# EAGLE design yetisponder_vesp02.2.1 (EAGLE 6.4)
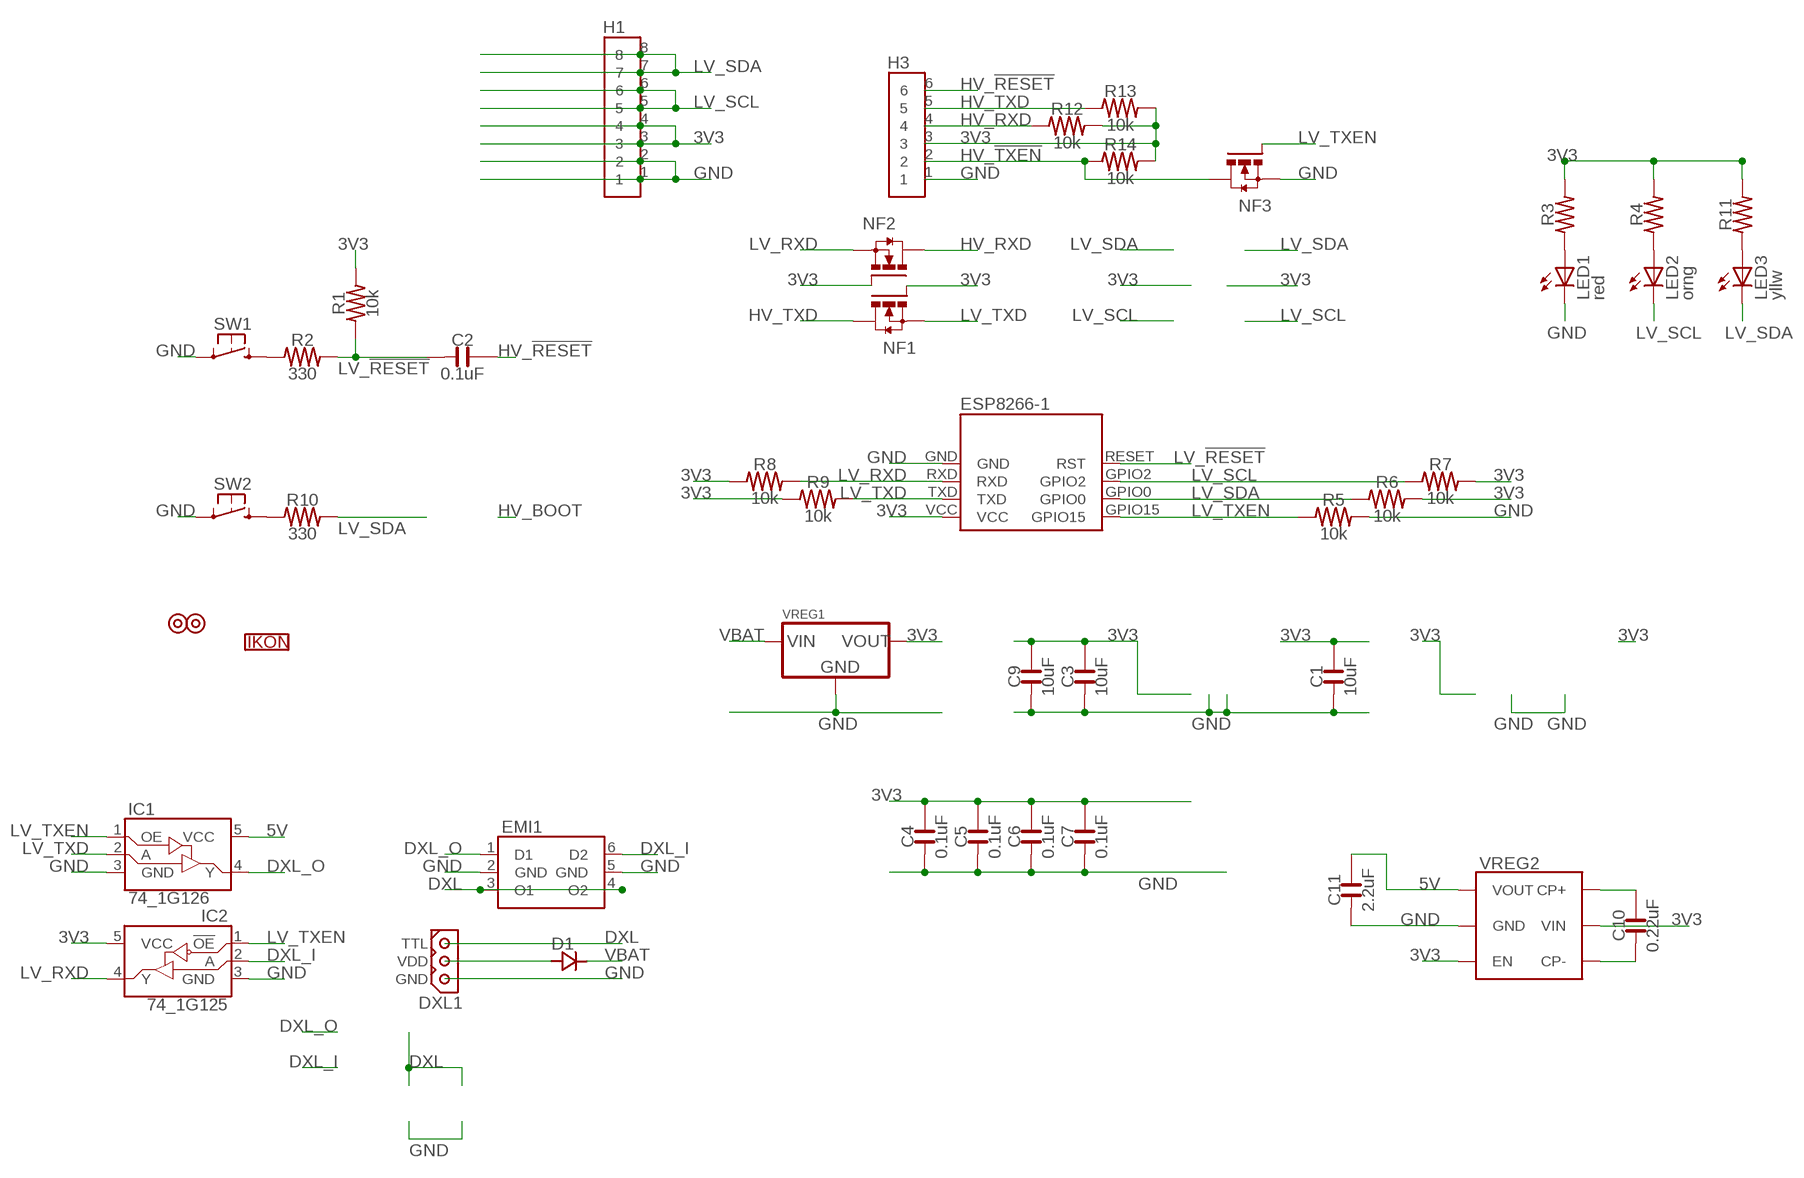
[diagram p0: schematic, sheet 1]

## Parts
C1  10uF  CAPACITOR-0805  [0805_YAGEO]
C2  0.1uF  CAPACITOR-0402  [0402_YAGEO]
C3  10uF  CAPACITOR-0805  [0805_YAGEO]
C4  0.1uF  CAPACITOR-0402  [0402_YAGEO]
C5  0.1uF  CAPACITOR-0402  [0402_YAGEO]
C6  0.1uF  CAPACITOR-0402  [0402_YAGEO]
C7  0.1uF  CAPACITOR-0402  [0402_YAGEO]
C9  10uF  CAPACITOR-0805  [0805_YAGEO]
C10  0.22uF  CAPACITOR-0402  [0402_YAGEO]
C11  2.2uF  CAPACITOR-0402  [0402_YAGEO]
D1  DIODE_RECTIFIER-POWER-DI5  [POWER-DI5]
DXL1  DXL_TTL-V  [MOLEX_5267-3]
EMI1  EMI_2CH  [SOT-563]
ESP8266-1  ESP8266-02  [ESP8266-02]
H1  HEADER_8P-0.1"_2X4-SMD-SULLINS  [HEADER-0.1"_2X4-SMD-SULLINS]
H3  HEADER_6P-0.1"  [HEADER-0.1"_1X6]
IC1  LOGIC_74_1G126-DCK  [DCK(R-PDSO-G5)_SC70]
IC2  LOGIC_74_1G125-DCK  [DCK(R-PDSO-G5)_SC70]
IKON1  IKON-VERSACOMA-5  [IKON_VERSACOMA_5MM]
LED1  red  LED-0402  [0402_LED]
LED2  orng  LED-0402  [0402_LED]
LED3  yllw  LED-0402  [0402_LED]
NF1  FET_N-CH-SOT-23-3  [SOT-23-3]
NF2  FET_N-CH-SOT-23-3  [SOT-23-3]
NF3  FET_N-CH-SOT-23-3  [SOT-23-3]
R1  10k  RESISTOR-0402  [0402_YAGEO]
R2  330  RESISTOR-0402  [0402_YAGEO]
R3  RESISTOR-0402  [0402_YAGEO]
R4  RESISTOR-0402  [0402_YAGEO]
R5  10k  RESISTOR-0402  [0402_YAGEO]
R6  10k  RESISTOR-0402  [0402_YAGEO]
R7  10k  RESISTOR-0402  [0402_YAGEO]
R8  10k  RESISTOR-0402  [0402_YAGEO]
R9  10k  RESISTOR-0402  [0402_YAGEO]
R10  330  RESISTOR-0402  [0402_YAGEO]
R11  RESISTOR-0402  [0402_YAGEO]
R12  10k  RESISTOR-0402  [0402_YAGEO]
R13  10k  RESISTOR-0402  [0402_YAGEO]
R14  10k  RESISTOR-0402  [0402_YAGEO]
S1  METRIC_SCREWS-M2.5_T  [M2.5_SCREW_TENTED]
S2  METRIC_SCREWS-M2.5_T  [M2.5_SCREW_TENTED]
SW1  SWITCH_SPST-6MMX6MM-PTH  [SWITCH_TE_1825910-7]
SW2  SWITCH_SPST-6MMX6MM-PTH  [SWITCH_TE_1825910-7]
VREG1  VREG_78XX-OKI-78SR-H  [VREG-OKI-78SR-H]
VREG2  VREG_REG710XX  [SOT-23-6]

## Nets
3V3: C1.2 C3.2 C4.2 C5.2 C6.2 C7.2 C9.2 ESP8266-1.VCC H1.3 H1.4 H3.3 IC2.5(VCC) NF1.1G(G) NF2.1G(G) R1.2 R3.2 R4.2 R6.2 R7.2 R8.1 R9.1 R11.2 R12.2 R13.2 R14.2 VREG1.3(VOUT) VREG2.3(EN) VREG2.5(VIN)
5V: C11.2 IC1.5(VCC) VREG2.1(VOUT)
DXL: DXL1.1(TTL) EMI1.3(O1) EMI1.4(O2)
DXL_I: EMI1.6(D2) IC2.2(A)
DXL_O: EMI1.1(D1) IC1.4(Y)
GND: C1.1 C3.1 C4.1 C5.1 C6.1 C7.1 C9.1 C11.1 DXL1.3(GND) EMI1.2(GND) EMI1.5(GND) ESP8266-1.GND H1.1 H1.2 H3.1 IC1.3(GND) IC2.3(GND) LED1.C NF3.2S(S) R5.2 SW1.2@1 SW1.2@2 SW2.2@1 SW2.2@2 VREG1.2(GND) VREG2.2(GND)
HV_!RESET!: C2.2 H3.6
HV_!TXEN!: H3.2 NF3.3D(D) R14.1
HV_RXD: H3.4 NF2.3D(D) R12.1
HV_TXD: H3.5 NF1.3D(D) R13.1
LV_!RESET!: C2.1 ESP8266-1.RESET(RST) R1.1 R2.2
LV_RXD: ESP8266-1.RXD IC2.4(Y) NF2.2S(S) R8.2
LV_SCL: ESP8266-1.GPIO2 H1.5 H1.6 LED2.C R7.1
LV_SDA: ESP8266-1.GPIO0 H1.7 H1.8 LED3.C R6.1 R10.2
LV_TXD: ESP8266-1.TXD IC1.2(A) NF1.2S(S) R9.2
LV_TXEN: ESP8266-1.GPIO15 IC1.1(OE) IC2.1(!OE!) NF3.1G(G) R5.1
N$1: R10.1 SW2.1@1 SW2.1@2
N$3: LED3.A R11.1
N$4: C10.2 VREG2.6(CP+)
N$5: D1.LEFT(A) D1.RIGHT(A) DXL1.2(VDD)
N$6: LED1.A R3.1
N$7: R2.1 SW1.1@1 SW1.1@2
N$8: LED2.A R4.1
N$9: C10.1 VREG2.4(CP-)
VBAT: D1.PAD(C) VREG1.1(VIN)
Unconnected: S1.P$1 S2.P$1

## Library data of the parts
C1-C7 C9-C11 = NaN:CAPACITOR
D1 = NaN:DIODE_RECTIFIER
DXL1 = NaN:DXL_TTL
EMI1 = NaN:EMI_2CH: 2CH EMI/ESD Filter NUF2230XV6 (D1-O1)(D2-O2)
ESP8266-1 = NaN:ESP8266-02
H1 = NaN:HEADER_8P
H3 = NaN:HEADER_6P
IC1 = NaN:LOGIC_74_1G126
IC2 = NaN:LOGIC_74_1G125
IKON1 = NaN:IKON
LED1-LED3 = NaN:LED: LEDs
NF1-NF3 = NaN:FET_N-CH
R1-R14 = NaN:RESISTOR
S1 S2 = NaN:METRIC_SCREWS
SW1 SW2 = NaN:SWITCH_SPST
VREG1 = NaN:VREG_78XX: 3-pin LDO Voltage Regulators SOT-23-3 IOG: Diodes, Inc. - AP7313, AP7333; Richtek - RT9058; GOI: Diodes, Inc. - AP2210, AP7313-R, AP7333-R; Microchip - MCP1700, MCP1702, MCP1745S; Richtek - RT9169L, RT9058L; GIO: Diodes, Inc. - AP1117; OGI: Richtek - RT9169; OIG: Diodes, Inc. - ZMRxxx; TI - LM3480; SOT-223 IGO: Diodes, Inc. - AZ1117-H2; AP2114-HA; Microchip - MCP1745S, MCP1826; GOI: Diodes, Inc. - AZ1117-H; AP2114-H; ST - LD1117; SOT-89-3 IGO: Diodes, Inc. - AP2204-R; Microchip - MCP1745S; IOG: Richtek - RT9058; GIO: Diodes, Inc. - AP1117, AZ1117-R2, AP2204-RA, ZXTR2012Z; Microchip - MCP1700, MCP1702; Ricktek - RT9169; GOI: Diodes, Inc. - AZ1117-R; OGI: Fairchild - MC78LxxA; TI - uA78L00; ST - L78L; POWER-DI5 GOI: Diodes, Inc. - ZXTR2012P5; TO-252-3 GOI: Diodes, Inc. - AZ1117, AP1117; ST - LD1117; TO-263-3 GOI: Diodes, Inc. - AP1117;
VREG2 = NaN:VREG_REG710XX

## Board
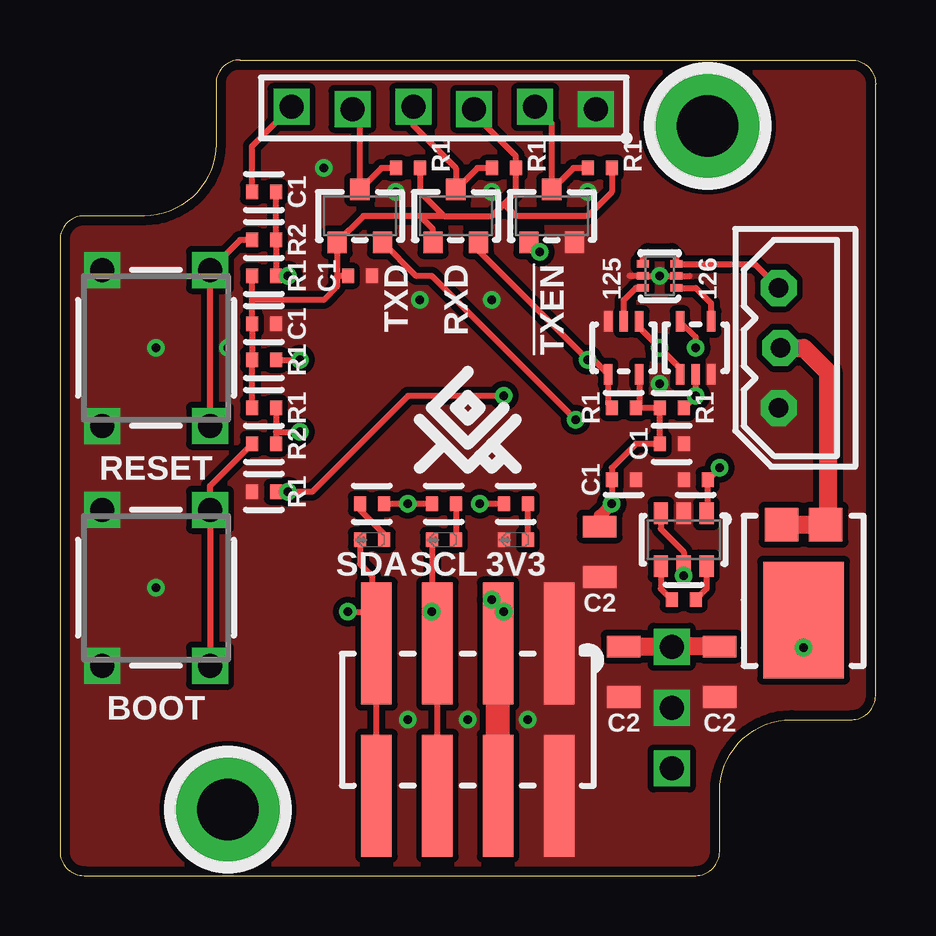
[diagram p1: board, top side]
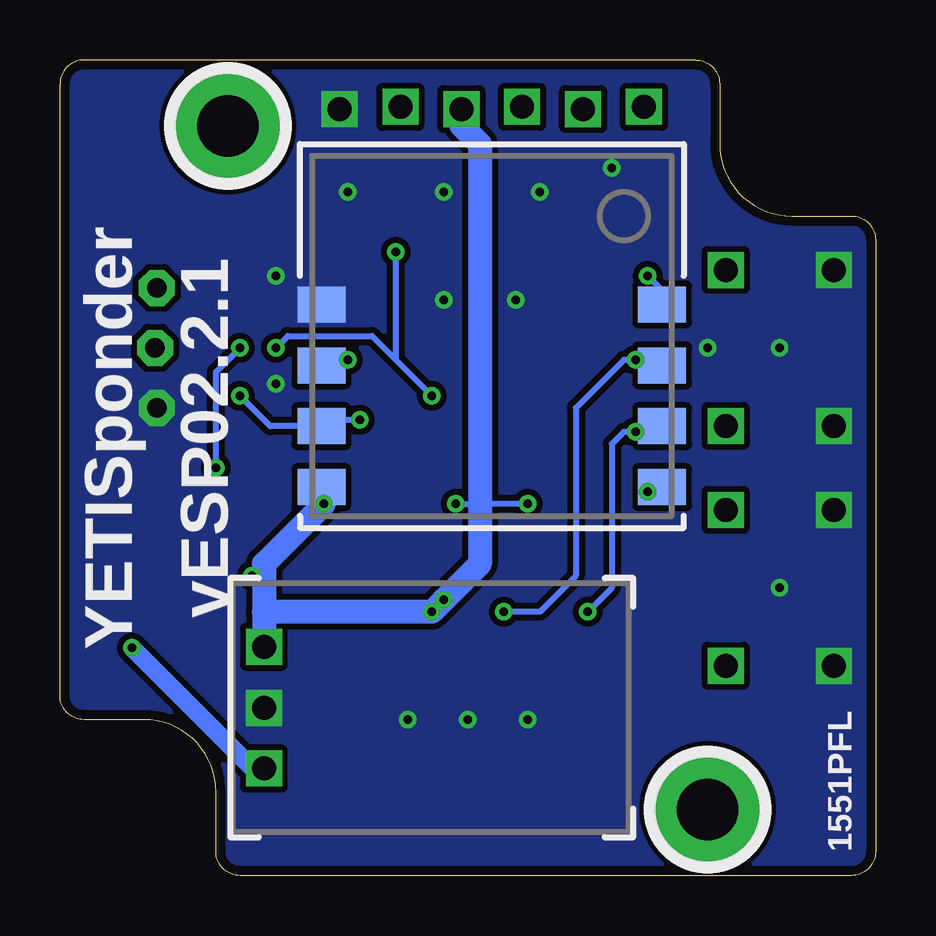
[diagram p2: board, bottom side, seen from below]

Size 34 x 34 mm. Coordinates in mm from the lower left corner, seen from the top.
Outline: 3.5,27.5 1,27.5 arc90 0,26.5 0,1 arc90 1,0 26.5,0 arc90 27.5,1 27.5,3.5 arc-90 30.5,6.5 33,6.5 arc90 34,7.5 34,33 arc90 33,34 7.5,34 arc90 6.5,33 6.5,30.5 arc-90 3.5,27.5
Copper layers (1*16): Top 0.0356mm / dielectric 1.5011mm / Bottom 0.0356mm
Design rules "LaenPCBOrder_mod_metric": minimum track width 0.16mm, minimum drill 0.35mm, track to track 0.16mm, track to pad 0.16mm, pad to pad 0.16mm, via to via 0.16mm, smd to smd 0mil, copper to edge 0.4mm, drill to drill 0.16mm, minimum pad ring 0.18mm, minimum via ring 0.18mm, stop-mask expansion 0.102mm, vias tented up to drill 2mm, thermal gap 10mil

### Footprints (pad centres in the part's own frame; a part is rotated, then mirrored left to right if it is on the bottom)
0805_YAGEO = smd 1.4 x 0.9: 1 0,1.05; 2 0,-1.05
0402_YAGEO = smd 0.6 x 0.5: 1 0,0.5; 2 0,-0.5
POWER-DI5 = smd 1.39 x 1.4: LEFT -0.92,-1.126; RIGHT 0.92,-1.126 | smd 3.36 x 4.86: PAD 0,2.856
MOLEX_5267-3 = drill 0.8 pad 1.5 octagon: 1 0.04,-2.5; 2 -0.04,0; 3 0.04,2.5
SOT-563 = smd 0.3 x 0.5: 1 -0.5,-0.7; 2 0,-0.7; 3 0.5,-0.7; 4 0.5,0.7; 5 0,0.7; 6 -0.5,0.7
ESP8266-02 = smd 2 x 1.5: GND -7.1,3.81; GPIO0 7.1,-1.27; GPIO2 7.1,1.27; GPIO15 7.1,-3.81; RESET 7.1,3.81; RXD -7.1,1.27; TXD -7.1,-1.27; VCC -7.1,-3.81
HEADER-0.1"_2X4-SMD-SULLINS = smd 1.27 x 5.08: 1 -3.81,-3.175; 2 -3.81,3.175; 3 -1.27,-3.175; 4 -1.27,3.175; 5 1.27,-3.175; 6 1.27,3.175; 7 3.81,-3.175; 8 3.81,3.175
HEADER-0.1"_1X6 = drill 1 square: 1 -6.35,0.05; 2 -3.81,-0.05; 3 -1.27,0.05; 4 1.27,-0.05; 5 3.81,0.05; 6 6.35,-0.05
DCK(R-PDSO-G5)_SC70 = smd 0.35 x 0.85: 1 -0.65,-1.1; 2 0,-1.1; 3 0.65,-1.1; 4 0.65,1.1; 5 -0.65,1.1
0402_LED = smd 0.6 x 0.5: A 0,-0.5; C 0,0.5
SOT-23-3 = smd 0.8 x 0.9: 1G -0.95,-1.1; 2S 0.95,-1.1; 3D 0,1.1
M2.5_SCREW_TENTED = drill 2.55 pad 5.2: P$1 0,0
SWITCH_TE_1825910-7 = drill 1 square: 1@1 -3.25,2.25; 1@2 3.25,2.25; 2@1 -3.25,-2.25; 2@2 3.25,-2.25
VREG-OKI-78SR-H = drill 1 square: 1 2.54,0; 2 0,0; 3 -2.54,0
SOT-23-6 = smd 0.6 x 0.9: 1 -0.95,-1.1; 2 0,-1.1; 3 0.95,-1.1; 4 0.95,1.1; 5 0,1.1; 6 -0.95,1.1

### Placement (x,y rotation side)
C1  22.5,13.5 180 top
C2  8.5,28.5 270 top
C3  27.5,8.5 180 top
C4  12.5,25 270 top
C5  23.5,16.5 270 top
C6  25.5,18 270 top
C7  8.5,23 270 top
C9  23.5,8.5 180 top
C10  26,11.5 90 top
C11  26.5,16.5 90 top
D1  31,13.5 180 top
DXL1  30,22 180 top
EMI1  25,25 90 top
ESP8266-1  16,20 0 bottom
H1  17,6.5 180 top
H3  16,32 180 top
IC1  26.5,22 0 top
IC2  23.5,22 180 top
IKON1  17,19 0 top
LED1  19,14 90 top
LED2  16,14 90 top
LED3  13,14 90 top
NF1  12.5,27.5 0 top
NF2  16.5,27.5 0 top
NF3  20.5,27.5 0 top
R1  8.5,25 270 top
R2  8.5,26.5 90 top
R3  19,15.5 270 top
R4  16,15.5 270 top
R5  8.5,16 270 top
R6  8.5,19.5 270 top
R7  8.5,21.5 270 top
R8  23.5,19.5 270 top
R9  25.5,19.5 90 top
R10  8.5,18 90 top
R11  13,15.5 90 top
R12  18.5,29.5 90 top
R13  14.5,29.5 90 top
R14  22.5,29.5 90 top
S1  7,2.75 0 top
S2  27,31.25 0 top
SW1  4,22 270 top
SW2  4,12 270 top
VREG1  25.5,7 270 bottom
VREG2  26,14 180 top

### Tracks (layer width: path | path; a pad name or v marks a point on that pad's centre or on a via)
3V3  (via drill 0.35)
  Top 0.25: R6.2 R7.2 C7.2 8,24 | NF2.1G 15.55,26.95 15,27.5 | 15,27.5 12.65,27.5 NF1.1G 11.55,25 | 8,24 R1.2 | 11.55,25 11.55,24.55 11,24 8,24 | C4.2 11.55,25 | v23,15.5 23,17 24,18 C6.2 R9.1 R8.1 24.15,19.65 IC2.5 | C5.2 v23,15.5 | R13.2 15,28.5 16,27.5 | 16,27.5 18,27.5 18.5,28 | 18.5,28 19,28.5 R12.2 19,30 17.27,31.73 H3.3 | R14.2 23,28.5 22,27.5 19,27.5 18.5,28 | 18,11 v18.5,11 | 16,27.5 15,27.5 | 23.1,15.6 v23,15.5 | VREG2.3 25.05,14.45 26,13.5 VREG2.5 | R4.2 v14.5,15.5 R11.2 | R3.2 v17.5,15.5
  Top 0.5: v18.5,11 18.5,9.9 H1.3 | C1.2 22.5,15 v23,15.5 | VREG2.5 v26,12.5
  Top 0.75: C3.2 VREG1.3 C9.2
  Top 1: H1.4 H1.3
  Bottom 0.25: v14.5,15.5 16.5,15.5 v17.5,15.5
  Bottom 0.5: ESP8266-1.VCC 23.1,15.6 v23,15.5 | v26,12.5 25.5,12.5
  Bottom 1: v23,15.5 25.5,13 25.5,12.5 25.5,11 | 25.5,11 v18.5,11 v18,11.5 16.5,13 16.5,15.5 16.5,30.5 17.27,31.27 H3.3 | 25.5,11 VREG1.3
5V  (via drill 0.35)
  Top 0.25: VREG2.1 27,15.15 C11.2 v27.5,17 | v26.5,22 26.5,22.45 IC1.5
  Bottom 0.25: v27.5,17 27.5,21 v26.5,22
DXL
  Top 0.25: EMI1.4 24.3,25.8 24.5,26 25.5,26 25.7,25.8 EMI1.3 28.96,25.5 DXL1.1
DXL_I
  Top 0.25: EMI1.6 24,24.5 23.5,24 IC2.2
DXL_O
  Top 0.25: EMI1.1 26.5,24.5 27.15,23.85 IC1.4
GND  (via drill 0.35)
  Top 0.25: 26.25,25 EMI1.2 v25,25 EMI1.5 23.75,25
  other vias: 4,12 4,22 11,29.5 15,24 14.5,6.5 17,6.5 19.5,6.5 18,24 14,28.5 22,28.5 18,28.5 25,20.5 7,22
  pour Top (isolate 0.25, rank 6, no thermals): 0,0 34,0 34,34 0,34
  pour Bottom (isolate 0.25, rank 6, no thermals): 0,0 34,0 34,34 0,34
HV_!RESET!
  Top 0.25: C2.2 8,30.4 H3.6
HV_!TXEN!
  Top 0.25: H3.2 20.5,31.36 NF3.3D 21.4,29.5 R14.1
HV_RXD
  Top 0.25: R12.1 17.4,29.5 NF2.3D 16.5,29.5 14.73,31.27 H3.4
HV_TXD
  Top 0.25: H3.5 12.5,31.64 NF1.3D 13.4,29.5 R13.1
LV_!RESET!  (via drill 0.35)
  Top 0.25: C2.1 R2.2 R1.1 v9.5,25
  Bottom 0.25: 8.81,23.81 ESP8266-1.RESET 8.9,24.4 v9.5,25
LV_RXD  (via drill 0.35)
  Top 0.25: NF2.2S 17.5,26.35 17.5,26 v22,21.5 22.25,21.5 IC2.4 22.85,19.65 R8.2
  Bottom 0.25: ESP8266-1.RXD 22.87,21.5 v22,21.5
LV_SCL  (via drill 0.35)
  Top 0.25: R7.1 v10,21.5 | H1.6 H1.5 15.73,11 v15.5,11 LED2.C
  Bottom 0.25: ESP8266-1.GPIO2 9.77,21.27 v10,21.5 10.5,21.5 12.5,19.5 12.5,12.5 14,11 v15.5,11
LV_SDA  (via drill 0.35)
  Top 0.25: R10.2 R6.1 9,18.5 v10,18.5 | H1.8 H1.7 13.19,11 13,11 | v12,11 13,11 | LED3.C 12.5,13 13,12.5 13,11
  Bottom 0.25: ESP8266-1.GPIO0 9.77,18.73 v10,18.5 10.5,18.5 11,18 11,12 v12,11
LV_TXD  (via drill 0.35)
  Top 0.25: NF1.2S 14.85,25 15.5,25 v21.5,19 | R9.2 v26.5,20 IC1.2
  Bottom 0.25: v26.5,20 25.23,18.73 ESP8266-1.TXD 22.77,18.73 22.5,19 v21.5,19
LV_TXEN  (via drill 0.35)
  Top 0.25: R5.1 v9.5,16 10.5,16 14.5,20 v18.5,20 | IC1.1 25.85,21.15 v25,22 24.15,22.85 IC2.1 | v20,26 20,25.95 NF3.1G
  Bottom 0.25: v18.5,20 20,21.5 | 20,21.5 v20,26 | ESP8266-1.GPIO15 9.31,16.19 v9.5,16 | v25,22 24.5,22.5 21,22.5 20,21.5
N$1
  Top 0.25: SW2.1@2 SW2.1@1 6.25,16.25 R10.1
N$3
  Top 0.25: R11.1 12.5,15.25 13.5,14.25 LED3.A
N$4
  Top 0.25: VREG2.6 26.95,11.95 C10.2
N$5
  Top 0.75: D1.RIGHT D1.LEFT 32,14.71 32,21 31,22 DXL1.2
N$6
  Top 0.25: LED1.A R3.1
N$7
  Top 0.25: SW1.1@2 SW1.1@1 7.5,26.5 R2.1
N$8
  Top 0.25: R4.1 LED2.A
N$9
  Top 0.25: VREG2.4 25.05,11.95 C10.1
VBAT  (via drill 0.35)
  Top 0.75: v31,9.5 D1.PAD
  Bottom 0.75: v31,9.5 26,4.5 25.54,4.5 VREG1.1

### Text on the board
tPlace: R1 | R1 | R1 | C1 | R2 | TXD | RXD | !TXEN! | R1 | C1 | 125 | 126 | C1 | R1 | R1 | R1 | R1 | RESET | R2 | C1 | R1 | C1 | SDA | SCL | 3V3 | C2 | BOOT | C2 | C2
bPlace: YETISponder / vESP02.2.1 | 1551PFL